# EAGLE design Totem Teensy (EAGLE 9.3.1)
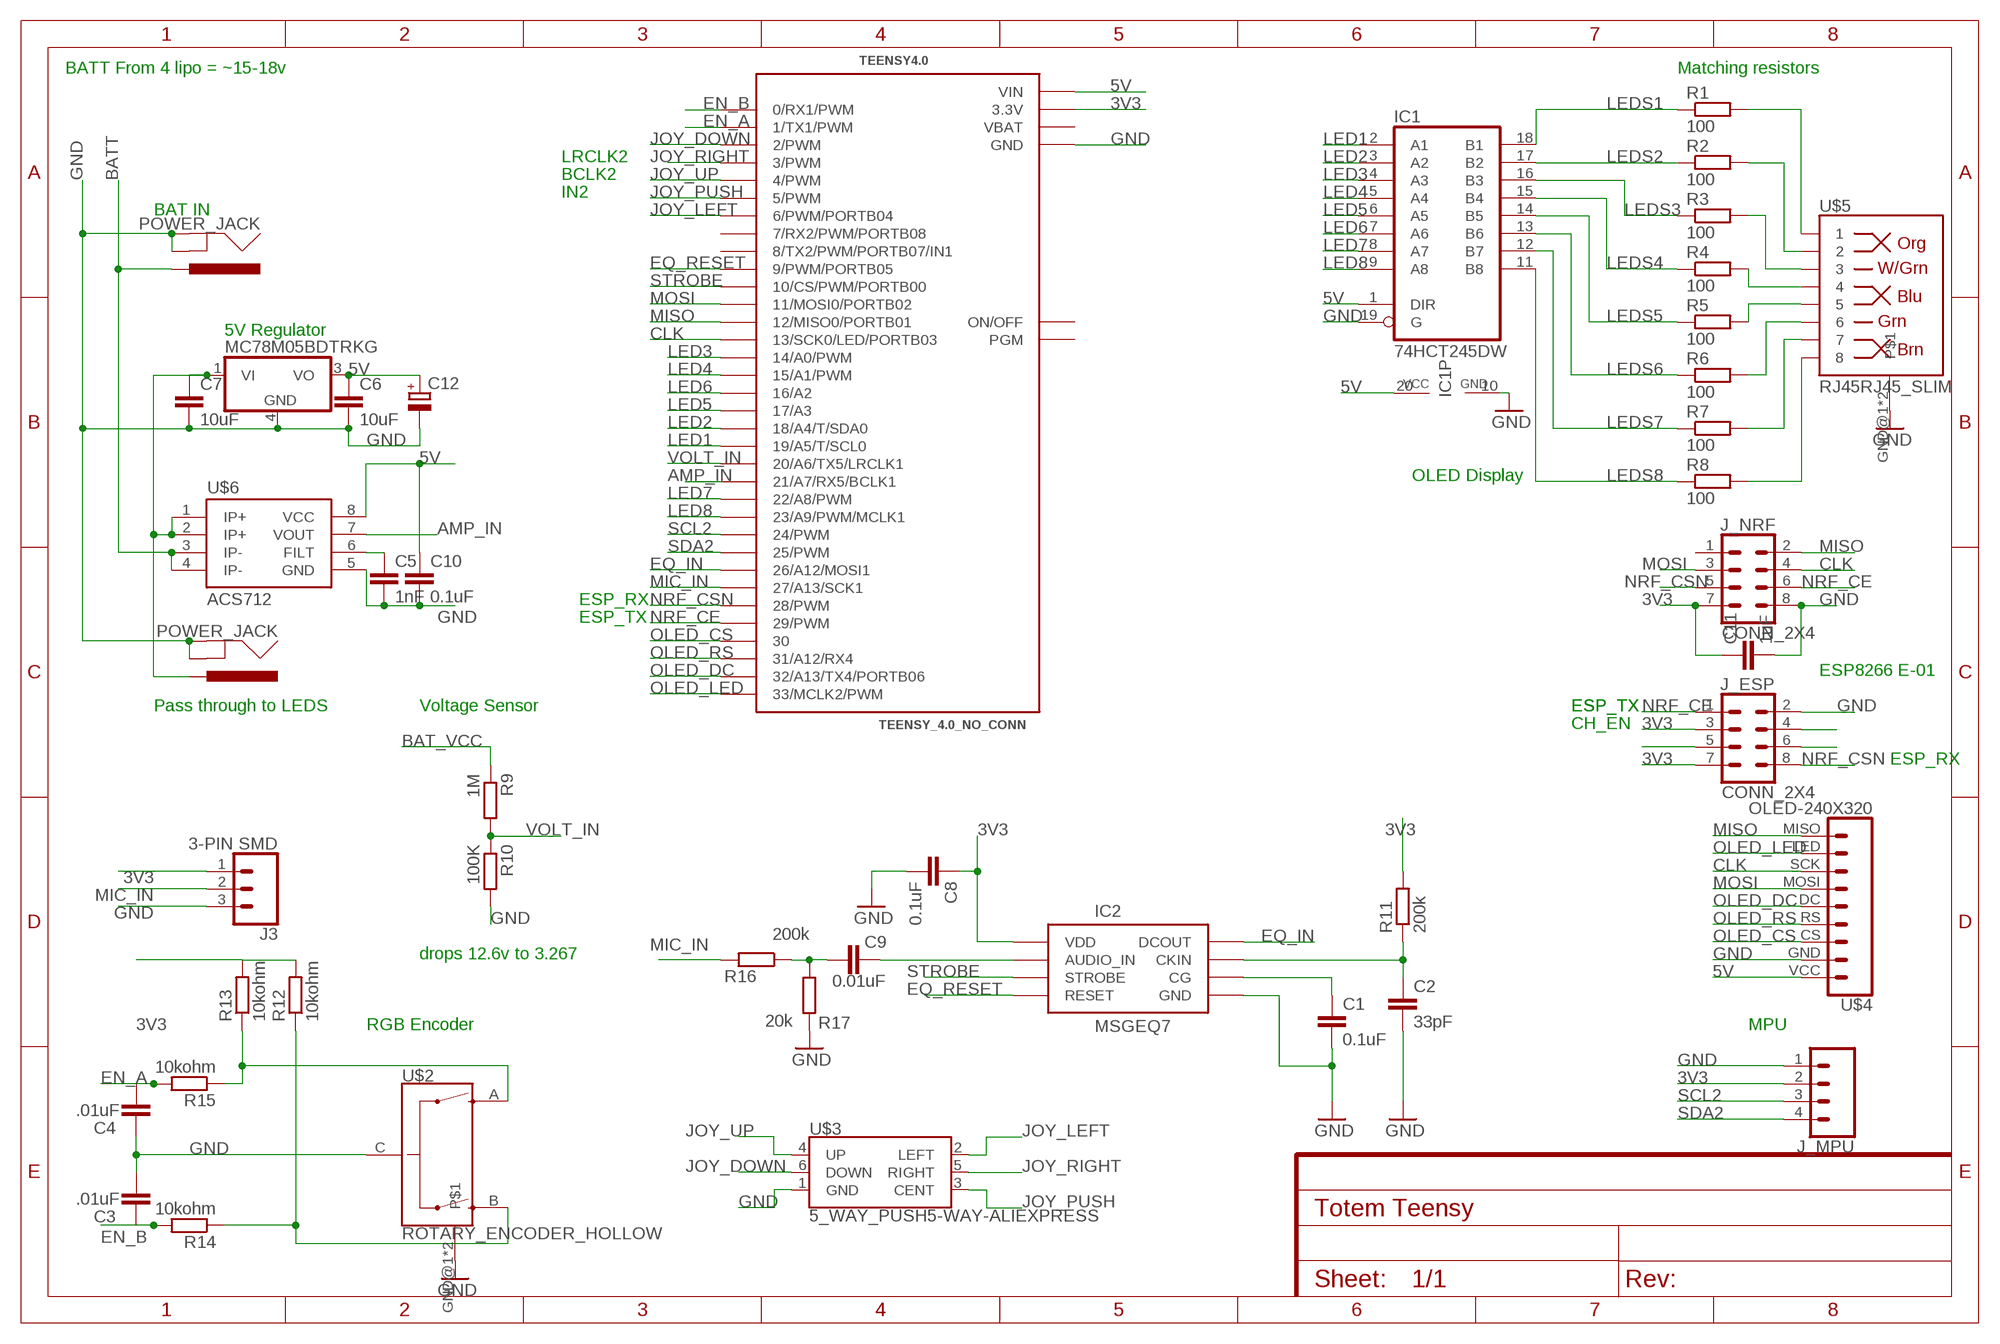
[diagram p0: schematic, sheet 1]

## Parts
C1  0.1uF  CC1206  [C1206]
C2  33pF  CC1206  [C1206]
C3  .01uF  CC1206  [C1206]
C4  .01uF  CC1206  [C1206]
C5  1nF  CC1206  [C1206]
C6  10uF  C-EUC1206  [C1206]
C7  10uF  C-EUC1206  [C1206]
C8  0.1uF  CC1206  [C1206]
C9  0.01uF  CC1206  [C1206]
C10  0.1uF  CC1206  [C1206]
C11  1uF  C-EUC1206  [C1206]
C12  CPOL-EUTT2D5L  [TT2D5L]
IC1  74HCT245DW  [SO20W]
IC2  MSGEQ7DIP  [DIL08]
IC3  MC78M05BDTRKG  [DPACK_3]
J1  POWER_JACK  [POWER_JACK_PTH]
J3  3-PIN SMD  CONN_03JST-SMD  [JST-3-SMD]
J7  POWER_JACK  [POWER_JACK_PTH]
J_ESP  CONN_2X4  [2X4]
J_MPU  CONN_04  [1X04]
J_NRF  CONN_2X4  [2X4]
R1  100  RR1206  [R1206]
R2  100  RR1206  [R1206]
R3  100  RR1206  [R1206]
R4  100  RR1206  [R1206]
R5  100  RR1206  [R1206]
R6  100  RR1206  [R1206]
R7  100  RR1206  [R1206]
R8  100  RR1206  [R1206]
R9  1M  R-EU_M1206  [M1206]
R10  100K  R-EU_M1206  [M1206]
R11  200k  RR1206  [R1206]
R12  10kohm  RR1206  [R1206]
R13  10kohm  RR1206  [R1206]
R14  10kohm  RR1206  [R1206]
R15  10kohm  RR1206  [R1206]
R16  200k  RR1206  [R1206]
R17  20k  RR1206  [R1206]
TEENSY4.0  TEENSY_4.0_NO_CONN  [TEENSY_4.0]
U$2  ROTARY_ENCODER_HOLLOW  [HOLLOW_ENCODER30R]
U$3  5_WAY_PUSH5-WAY-ALIEXPRESS  [5-WAY_PTH2]
U$4  OLED-240X320  [OLED_240X320]
U$5  RJ45RJ45_SLIM  [RJ45_SLIM]
U$6  ACS712  [SO08]

## Nets
3V3: C8.1 C11.1 IC2.1(VDD) J3.1 J_ESP.3 J_ESP.7 J_MPU.2 J_NRF.7 R11.2 R12.2 R13.2 TEENSY4.0.3.3@0(3.3V) TEENSY4.0.3.3@1(3.3V)
5V: C6.1 C10.1 C12.+ IC1.1(DIR) IC1.20(VCC) IC3.3(VO) TEENSY4.0.VIN U$4.VCC U$6.8(VCC)
AMP_IN: TEENSY4.0.21/A7(21/A7/RX5/BCLK1) U$6.7(VOUT)
BAT_VCC: C7.1 IC3.1(VI) J7.PWR R9.1 U$6.1(IP+) U$6.2(IP+)
BATT: J1.PWR U$6.3(IP-) U$6.4(IP-)
CLK: J_NRF.4 TEENSY4.0.13(13/SCK0/LED/PORTB03) U$4.SCK(CLK)
EN_A: C4.1 R15.2 TEENSY4.0.1(1/TX1/PWM)
EN_B: C3.2 R14.2 TEENSY4.0.0(0/RX1/PWM)
EQ_IN: IC2.3(DCOUT) TEENSY4.0.26(26/A12/MOSI1)
EQ_RESET: IC2.7(RESET) TEENSY4.0.9(9/PWM/PORTB05)
GND: C1.2 C2.2 C3.1 C4.2 C5.2 C6.2 C7.2 C8.2 C10.2 C11.2 C12.- IC1.10(GND) IC1.19(G) IC2.2(GND) IC3.4(GND) J1.GND J1.GNDBREAK J3.3 J7.GND J7.GNDBREAK J_ESP.2 J_MPU.1 J_NRF.8 R10.2 R17.2 TEENSY4.0.GND@0(GND) TEENSY4.0.GND@1(GND) TEENSY4.0.GND@2(GND) U$2.C U$2.GND@1 U$2.GND@2 U$3.1(GND) U$4.GND U$5.GND@1 U$5.GND@2 U$6.5(GND)
JOY_DOWN: TEENSY4.0.2(2/PWM) U$3.6(DOWN)
JOY_LEFT: TEENSY4.0.6(6/PWM/PORTB04) U$3.2(LEFT)
JOY_PUSH: TEENSY4.0.5(5/PWM) U$3.3(CENT)
JOY_RIGHT: TEENSY4.0.3(3/PWM) U$3.5(RIGHT)
JOY_UP: TEENSY4.0.4(4/PWM) U$3.4(UP)
LED1: IC1.2(A1) TEENSY4.0.19/A5(19/A5/T/SCL0)
LED2: IC1.3(A2) TEENSY4.0.18/A4(18/A4/T/SDA0)
LED3: IC1.4(A3) TEENSY4.0.14/A0(14/A0/PWM)
LED4: IC1.5(A4) TEENSY4.0.15/A1(15/A1/PWM)
LED5: IC1.6(A5) TEENSY4.0.17/A3
LED6: IC1.7(A6) TEENSY4.0.16/A2
LED7: IC1.8(A7) TEENSY4.0.22/A8(22/A8/PWM)
LED8: IC1.9(A8) TEENSY4.0.23/A9(23/A9/PWM/MCLK1)
LEDS1: IC1.18(B1) R1.1
LEDS2: IC1.17(B2) R2.1
LEDS3: IC1.16(B3) R3.1
LEDS4: IC1.15(B4) R4.1
LEDS5: IC1.14(B5) R5.1
LEDS6: IC1.13(B6) R6.1
LEDS7: IC1.12(B7) R7.1
LEDS8: IC1.11(B8) R8.1
MIC_IN: J3.2 R16.2 TEENSY4.0.27(27/A13/SCK1)
MISO: J_NRF.2 TEENSY4.0.12(12/MISO0/PORTB01) U$4.MISO
MOSI: J_NRF.3 TEENSY4.0.11(11/MOSI0/PORTB02) U$4.MOSI
N$1: R1.2 U$5.8
N$2: R2.2 U$5.7
N$3: R4.2 U$5.5
N$4: R3.2 U$5.6
N$5: R5.2 U$5.4
N$6: R6.2 U$5.3
N$7: R7.2 U$5.2
N$8: R8.2 U$5.1
N$9: J_ESP.4
N$10: J_ESP.6
N$11: J_ESP.5
N$19: C9.2 R16.1 R17.1
N$20: C9.1 IC2.5(AUDIO_IN)
N$21: C5.1 U$6.6(FILT)
N$25: R13.1 R15.1 U$2.A
N$26: R12.1 R14.1 U$2.B
N$27: C2.1 IC2.8(CKIN) R11.1
N$29: C1.1 IC2.6(CG)
NRF_CE: J_ESP.1 J_NRF.6 TEENSY4.0.29(29/PWM)
NRF_CSN: J_ESP.8 J_NRF.5 TEENSY4.0.28(28/PWM)
OLED_CS: TEENSY4.0.30 U$4.CS
OLED_DC: TEENSY4.0.32(32/A13/TX4/PORTB06) U$4.DC
OLED_LED: TEENSY4.0.33(33/MCLK2/PWM) U$4.LED
OLED_RS: TEENSY4.0.31(31/A12/RX4) U$4.RS
SCL2: J_MPU.3 TEENSY4.0.24(24/PWM)
SDA2: J_MPU.4 TEENSY4.0.25(25/PWM)
STROBE: IC2.4(STROBE) TEENSY4.0.10(10/CS/PWM/PORTB00)
VOLT_IN: R9.2 R10.1 TEENSY4.0.20/A6(20/A6/TX5/LRCLK1)
Unconnected: J_NRF.1 TEENSY4.0.7(7/RX2/PWM/PORTB08) TEENSY4.0.8(8/TX2/PWM/PORTB07/IN1) TEENSY4.0.ON/OFF TEENSY4.0.PGM

## Notes on the sheet
- BATT From 4 lipo = ~15-18v | Matching resistors
- LRCLK2
- BCLK2
- IN2
- BAT IN
- 5V Regulator
- OLED Display
- ESP_RX
- ESP_TX
- ESP8266 E-01
- Pass through to LEDS | Voltage Sensor | ESP_TX | ESP_TX
- CH_EN
- ESP_RX
- drops 12.6v to 3.267
- RGB Encoder | MPU

## Power pins joined to a net without a drawn wire
VBAT: TEENSY4.0.VBAT

## Library data of the parts
C1-C5 C8-C10 = eagle-ltspice:C: CAPACITOR, European symbol; SPICEMODEL: NONE; SPICEPREFIX: C
C6 C7 C11 = rcl:C-EU: CAPACITOR, European symbol; SPICEPREFIX: C
C12 = rcl:CPOL-EU: POLARIZED CAPACITOR, European symbol; SPICEPREFIX: C
IC1 = 74xx-eu:74*245: Octal BUS TRANSCEIVER, 3-state
IC2 = msgeq7:MSGEQ7: 7-band graphic equalizer
IC3 = linear:MC78M: 500 mA Positive Voltage Regulators Source: Data sheet <http://www.onsemi.com/pub_link/Collateral/MC78M00-D.PDF>
J1 J7 = SparkFun-Connectors:POWER_JACK: Power Jack Connector This is the standard 5.5mm barrel jack for power. The PTH is the most common, proven, reliable, footprint. The Slot footprint only works if the mill layer is transmitted to the PCB fab house so be warned. Here are the connectors we sell at SparkFun: DC Barrel Power Jack/Connector <https://www.sparkfun.com/products/119> (PRT-00119) DC Barrel Power Jack/Connector (SMD) <https://www.sparkfun.com/products/12748> (PRT-12748) DC Barrel Jack Adapter - Breadboard Compatible <https://www.sparkfun.com/products/10811> (PRT-10811) It is used on this SparkFun product (and many, many others): SparkFun RedBoard - Programmed with Arduino <https://www.sparkfun.com/products/12757> (DEV-12757) Also, if you need a mating power supply or connector, please check these out: Wall Adapter Power Supply - 9VDC 650mA <https://www.sparkfun.com/products/298> (TOL-00298) DC Barrel Jack Adapter - Male <https://www.sparkfun.com/products/10287> (PRT-10287); PROD_ID: CONN-08197
J3 = SparkFun-Connectors:CONN_03: Multi connection point. Often used as Generic Header-pin footprint for 0.1 inch spaced/style header connections On any of the 0.1 inch spaced packages, you can populate with these: Break Away Headers - Straight <https://www.sparkfun.com/products/116> (PRT-00116) Break Away Male Headers - Right Angle <https://www.sparkfun.com/products/553> (PRT-00553) Female Headers <https://www.sparkfun.com/products/115> (PRT-00115) Break Away Headers - Machine Pin <https://www.sparkfun.com/products/117> (PRT-00117) Break Away Female Headers - Swiss Machine Pin <https://www.sparkfun.com/products/743> (PRT-00743) Stackable Header - 3 Pin (Female, 0.1") <https://www.sparkfun.com/products/13875> (PRT-13875) For SCREWTERMINALS and SPRING TERMINALS visit here: Screw Terimnals on SparkFun.com <https://www.sparkfun.com/search/results?term=Screw+Terminals> (5mm/3.5mm/2.54mm spacing) This device is also useful as a general connection point to wire up your design to another part of your project. Our various solder wires solder well into these plated through hole pads. Hook-Up Wire - Assortment (Stranded, 22 AWG) <https://www.sparkfun.com/products/11375> (PRT-11375) Hook-Up Wire - Assortment (Solid Core, 22 AWG) <https://www.sparkfun.com/products/11367> (PRT-11367) View the entire wire category on our website here <https://www.sparkfun.com/categories/141> Special notes: Molex polarized connector foot print use with SKU : PRT-08232 with associated crimp pins and housings.; PROD_ID: CONN-12591
J_ESP J_NRF = myParts:CONN_2X4
J_MPU = SparkFun-Connectors:CONN_04: Multi connection point. Often used as Generic Header-pin footprint for 0.1 inch spaced/style header connections On any of the 0.1 inch spaced packages, you can populate with these: Break Away Headers - Straight <https://www.sparkfun.com/products/116> (PRT-00116) Break Away Male Headers - Right Angle <https://www.sparkfun.com/products/553> (PRT-00553) Female Headers <https://www.sparkfun.com/products/115> (PRT-00115) Break Away Headers - Machine Pin <https://www.sparkfun.com/products/117> (PRT-00117) Break Away Female Headers - Swiss Machine Pin <https://www.sparkfun.com/products/743> (PRT-00743) For SCREWTERMINALS and SPRING TERMINALS visit here: Screw Terimnals on SparkFun.com <https://www.sparkfun.com/search/results?term=Screw+Terminals> (5mm/3.5mm/2.54mm spacing) This device is also useful as a general connection point to wire up your design to another part of your project. Our various solder wires solder well into these plated through hole pads. Hook-Up Wire - Assortment (Stranded, 22 AWG) <https://www.sparkfun.com/products/11375> (PRT-11375) Hook-Up Wire - Assortment (Solid Core, 22 AWG) <https://www.sparkfun.com/products/11367> (PRT-11367) View the entire wire category on our website here <https://www.sparkfun.com/categories/141> Special notes: Molex polarized connector foot print use with SKU : PRT-08231 with associated crimp pins and housings. 1MM SMD Version SKU: PRT-10208; PROD_ID: CONN-09696
R1-R8 R11-R17 = eagle-ltspice:R: RESISTOR, European symbol; SPICEMODEL: NONE; SPICEPREFIX: R
R9 R10 = rcl:R-EU_: RESISTOR, European symbol; SPICEPREFIX: R
TEENSY4.0 = Teensy_3_and_LC_Series_Boards_v1.5:TEENSY_4.0_NO_CONN
U$2 = myParts:ROTARY_ENCODER_HOLLOW: https://au.mouser.com/datasheet/2/15/SRGPSJ-1155941.pdf
U$3 = myParts:5_WAY_PUSH: pth2 - https://www.aliexpress.com/item/33020121294.html?spm=a2g0s.9042311.0.0.75f24c4dOQCrTt
U$4 = myParts:OLED-240X320
U$5 = myParts:RJ45: Regular one https://www.digikey.com.au/product-detail/en/assmann-wsw-components/A-2004-2-4-LP-S-R/AE10388-ND/2183639 Same as one from ali express too Slim one https://www.aliexpress.com/item/32974903992.html?spm=a2g0s.9042311.0.0.62954c4dfgLHeB
U$6 = SparkFun-Sensors:ACS712: ACS712 Hall-effect-based isolated linear current sensor Datasheet <http://www.sparkfun.com/datasheets/BreakoutBoards/0712.pdf> SparkFun Products SparkFun Low Current Sensor Breakout - ACS712 <https://www.sparkfun.com/products/8883> (SEN-08883); PROD_ID: IC-08964

## Board
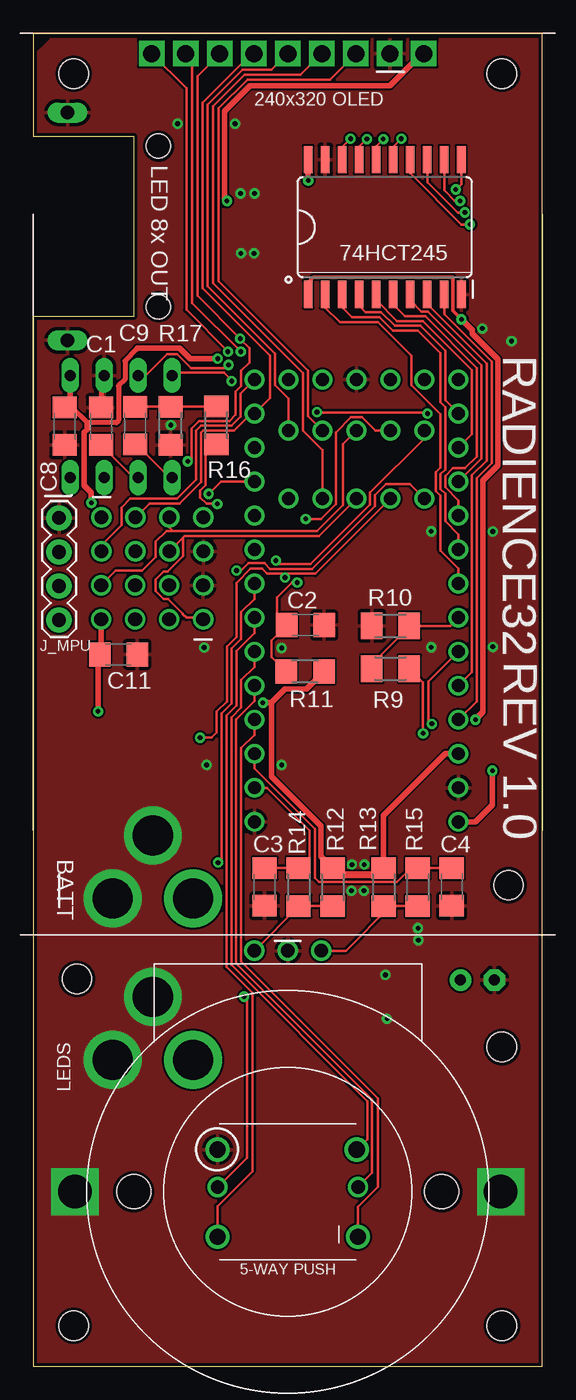
[diagram p1: board, top side]
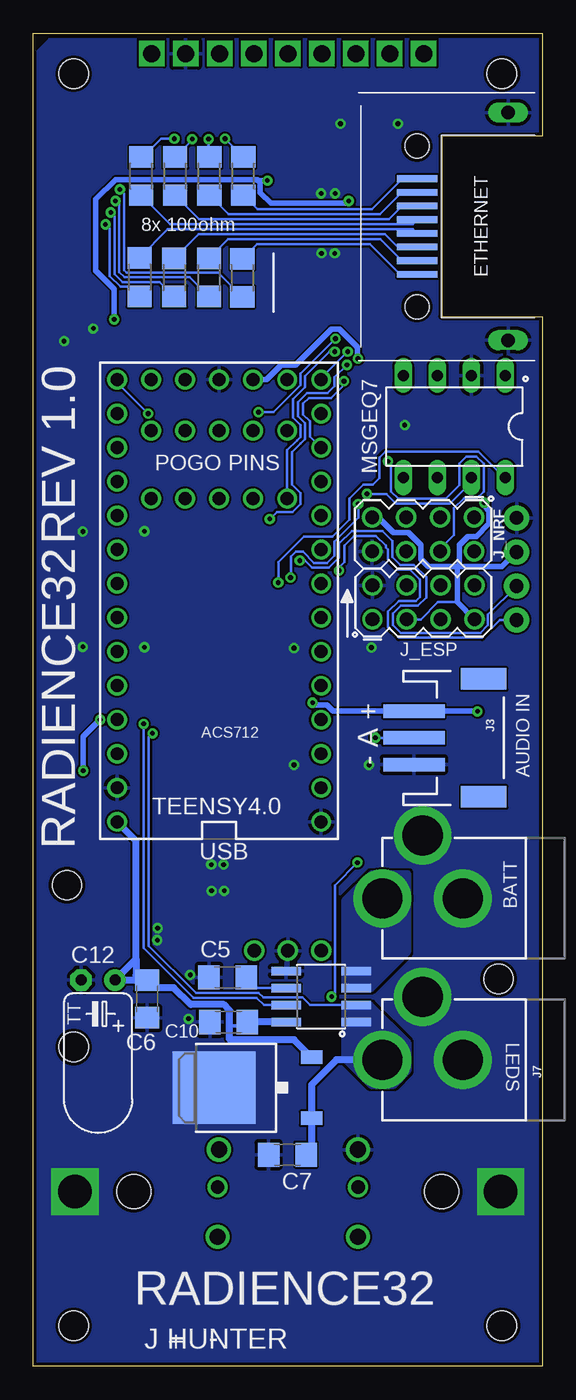
[diagram p2: board, bottom side, seen from below]

Size 38 x 99.5 mm. Coordinates in mm from the lower left corner, seen from the top.
Outline: 0,0 38,0 38,99.5 0,99.5 0,91.82 7.49,91.82 7.49,78.36 0,78.36 0,0
Copper layers (1*16): Top 0.035mm / dielectric 1.5mm / Bottom 0.035mm
Design rules "default *": minimum track width 6mil, minimum drill 0.3mm, track to track 6mil, track to pad 6mil, pad to pad 6mil, via to via 6mil, smd to smd 6mil, copper to edge 10mil, drill to drill 6mil, minimum pad ring 10mil, minimum via ring 8mil, stop-mask expansion 4mil, vias tented up to drill 0mil, thermal gap 10mil
Holes 2.2 mm at 35,3 3,3 35,96.5 3,96.5 3.25,28.9 35,23.82 35.5,35.9

### Footprints (pad centres in the part's own frame; a part is rotated, then mirrored left to right if it is on the bottom)
C1206 = smd 1.6 x 1.8: 1 -1.4,0; 2 1.4,0
TT2D5L = drill 0.813 pad 1.6: + -1.27,0 | drill 0.813 pad 1.6 octagon: - 1.27,0
SO20W = smd 0.66 x 2.032: 1 -5.715,-5.029; 2 -4.445,-5.029; 3 -3.175,-5.029; 4 -1.905,-5.029; 5 -0.635,-5.029; 6 0.635,-5.029; 7 1.905,-5.029; 8 3.175,-5.029; 9 4.445,-5.029; 10 5.715,-5.029; 11 5.715,5.029; 12 4.445,5.029; 13 3.175,5.029; 14 1.905,5.029; 15 0.635,5.029; 16 -0.635,5.029; 17 -1.905,5.029; 18 -3.175,5.029; 19 -4.445,5.029; 20 -5.715,5.029
DIL08 = drill 0.813 long: 1 -3.81,-3.81; 2 -1.27,-3.81; 3 1.27,-3.81; 4 3.81,-3.81; 5 3.81,3.81; 6 1.27,3.81; 7 -1.27,3.81; 8 -3.81,3.81
DPACK_3 = smd 1 x 1.6: 1 -2.28,-4.8; 3 2.28,-4.8 | smd 5.4 x 6.2: 4 0,2.5
POWER_JACK_PTH = drill 2.997 pad 4.318: GND 0,7.7; GNDBREAK 4.7,10.7; PWR 0,13.7
JST-3-SMD = smd 1 x 4.6: 1 -1.99,-4.77; 2 0.01,-4.77; 3 2.01,-4.77 | smd 1.6 x 3.4: NC1 -4.39,0.43; NC2 4.41,0.43
2X4 = drill 1.016: 1 -3.81,-1.27; 2 -3.81,1.27; 3 -1.27,-1.27; 4 -1.27,1.27; 5 1.27,-1.27; 6 1.27,1.27; 7 3.81,-1.27; 8 3.81,1.27
1X04 = drill 1.016 pad 1.88: 1 0,0; 2 2.54,0; 3 5.08,0; 4 7.62,0
R1206 = smd 1.6 x 1.803: 1 -1.422,0; 2 1.422,0
M1206 = smd 1.6 x 2: 1 -1.4,0; 2 1.4,0
TEENSY_4.0 = drill 0.965: 0 -7.62,13.97; 1 -7.62,11.43; 2 -7.62,8.89; 3 -7.62,6.35; 3.3@0 -2.54,-16.51; 3.3@1 7.62,11.43; 4 -7.62,3.81; 5 -7.62,1.27; 6 -7.62,-1.27; 7 -7.62,-3.81; 8 -7.62,-6.35; 9 -7.62,-8.89; 10 -7.62,-11.43; 11 -7.62,-13.97; 12 -7.62,-16.51; 13 7.62,-16.51; 14/A0 7.62,-13.97; 15/A1 7.62,-11.43; 16/A2 7.62,-8.89; 17/A3 7.62,-6.35; 18/A4 7.62,-3.81; 19/A5 7.62,-1.27; 20/A6 7.62,1.27; 21/A7 7.62,3.81; 22/A8 7.62,6.35; 23/A9 7.62,8.89; 24 5.08,-12.7; 25 5.08,-7.62; 26 2.54,-12.7; 27 2.54,-7.62; 28 0,-12.7; 29 0,-7.62; 30 -2.54,-12.7; 31 -2.54,-7.62; 32 -5.08,-12.7; 33 -5.08,-7.62; GND@0 -7.62,16.51; GND@1 7.62,13.97; GND@2 0,-16.51; ON/OFF 5.08,-16.51; PGM 2.54,-16.51; VBAT -5.08,-16.51; VIN 7.62,16.51
HOLLOW_ENCODER30R = drill 1: A -2.5,-18; B 2.5,-18; C 0,-18 | drill 2.5 pad 3 square: GND@1 -15.9,0; GND@2 15.9,0 | hole 2.55: -11.5,0; 11.5,0
5-WAY_PTH2 = drill 1.2: 1 -5.25,3.15; 3 -5.25,-3.35; 4 5.15,3.15; 6 5.25,-3.35 | drill 1: 2 -5.25,0.35; 5 5.25,0.35
OLED_240X320 = drill 1.27 square: CS 5.08,0; DC 0,0; GND 7.62,0; LED -7.62,0; MISO -10.16,0; MOSI -2.54,0; RS 2.54,0; SCK -5.08,0; VCC 10.16,0
RJ45_SLIM = smd 0.5 x 3: 1 -3.57,6.8; 2 -2.55,6.8; 3 -1.53,6.8; 4 -0.51,6.8; 5 0.51,6.8; 6 1.53,6.8; 7 2.55,6.8; 8 3.57,6.8 | drill 1 long: GND@1 8.5,0; GND@2 -8.5,0 | hole 1.8: -6,6.8; 6,6.8
SO08 = smd 0.61 x 2.21: 1 -1.905,-2.616; 2 -0.635,-2.616; 3 0.635,-2.616; 4 1.905,-2.616; 5 1.905,2.616; 6 0.635,2.616; 7 -0.635,2.616; 8 -1.905,2.616

### Placement (x,y rotation side)
C1  5.05,70.18 90 top
C2  20.32,55.32 0 top
C3  17.27,35.76 90 top
C4  31.24,35.76 270 top
C5  23.5,29.03 180 bottom
C6  29.51,27.41 270 bottom
C7  19.03,15.77 180 bottom
C8  2.34,70.18 270 top
C9  7.59,70.21 90 top
C10  23.42,25.68 180 bottom
C11  6.35,53.14 0 top
C12  33.17,28.83 180 bottom
IC1  26.24,85.04 0 top
IC2  6.55,70.15 180 bottom
IC3  22.02,20.78 90 bottom
J1  -1.78,34.92 90 bottom
J3  4.8,46.91 270 bottom
J7  -1.78,22.86 90 bottom
J_ESP  8.86,57.02 0 bottom
J_MPU  1.91,63.32 270 top
J_NRF  8.89,62.1 180 bottom
R1  22.33,88.85 270 bottom
R2  24.87,88.85 270 bottom
R3  27.41,88.85 270 bottom
R4  29.95,88.85 270 bottom
R5  30.07,81.31 90 bottom
R6  27.48,81.28 90 bottom
R7  24.89,81.28 90 bottom
R8  22.4,81.25 90 bottom
R9  26.67,52.07 180 top
R10  26.67,55.27 180 top
R11  20.29,51.87 0 top
R12  22.35,35.76 90 top
R13  26.16,35.76 90 top
R14  19.81,35.76 90 top
R15  28.7,35.76 90 top
R16  13.67,70.23 270 top
R17  10.24,70.21 270 top
TEENSY4.0  24.13,57.15 180 bottom
U$2  19,13.01 180 top
U$3  19,13.01 0 top
U$4  19,98 0 top
U$5  2.54,85.09 90 bottom
U$6  16.51,27.58 90 bottom

### Tracks (layer width: path | path; a pad name or v marks a point on that pad's centre or on a via)
3V3  (via drill 0.35)
  Top 0.203: 5.05,53.24 C11.1
  Top 0.356: 7.76,76 7.76,75.96 6.83,75.04 6.83,73.66 6.36,73.19 6.36,70.6 6.21,70.44 4.01,70.44 2.87,71.58 C8.1
  Top 0.406: TEENSY4.0.3.3@1 30.76,45.72 26.16,41.12 R13.2 | IC2.1 2.74,71.99 C8.1 | v13.76,75.22 11.71,75.22 10.93,76 7.76,76 | R11.2 20.41,50.56 18.81,50.56 17.78,49.53 | 17.78,49.53 17.78,48.26 | 17.78,48.26 17.78,44 21.48,40.31 21.48,38.06 R12.2 | 17.78,49.53 17.78,48.26 | 17.78,49.53 v17.14,49.53 | J_ESP.7 5.05,53.24 | C11.1 4.83,53.01 v4.83,48.88 | v4.33,64.45 4.33,65.2 3.8,65.73 3.8,69.73 4,69.93 4,70.44 4.01,70.44
  Top 0.508: R12.2 22.88,36.66 25.63,36.66 R13.2
  Bottom 0.203: 6.35,57.05 7.77,57.05 9.07,55.75 J_ESP.3 | J3.1 10.16,48.9
  Bottom 0.406: J_NRF.7 12.27,63.37 11.12,62.23 9.98,62.23 9.04,61.3 9.04,60.24 8.49,59.69 6.35,59.69 | J_MPU.2 3,59.69 6.35,59.69 | J_ESP.7 6.35,57.05 6.35,59.69 | v13.76,75.22 13.79,75.25 13.79,76.1 15.14,77.44 15.75,77.44 18.44,74.75 19.5,74.75 20.59,73.66 TEENSY4.0.3.3@0 | v17.14,49.53 16.96,49.35 16.06,49.35 15.61,48.9 10.16,48.9 J3.1 4.85,48.9 v4.83,48.88 | v4.33,64.45 4.33,64.2 3.96,63.84 3.96,62.91 4.92,61.95 5.54,61.95 6.2,61.3 6.2,59.84 6.35,59.69
5V  (via drill 0.35)
  Top 0.254: v31.98,78.16 31.32,78.82 31.32,81.31 20.92,81.31 20.58,80.97 20.52,80.97 IC1.1
  Top 0.406: v20.52,88.52 IC1.20 | v14.45,87 14.28,87.17 14.28,93.71 16.17,95.61 26.63,95.61 29.03,98 U$4.VCC | v31.98,78.16 32.79,77.34 32.79,77.07 34.7,75.17 34.7,67.25 33.58,66.13 33.58,48.82 v33.02,48.26 | v34.29,44.45 34.29,41.91 33.02,40.64 TEENSY4.0.VIN
  Bottom 0.254: 23.34,25.4 22.3,25.4 C10.1
  Bottom 0.406: v20.52,88.52 21.21,88.52 21.29,88.59 21.59,88.59 | v31.98,78.16 31.98,80.42 33.35,81.78 33.35,87.12 31.88,88.59 21.59,88.59 | 21.59,88.59 21.58,88.58 21.28,88.58 21.07,88.37 21.07,87.63 20.26,86.82 14.62,86.82 v14.45,87 | v33.02,48.26 34.29,46.99 v34.29,44.45
  Bottom 0.508: TEENSY4.0.VIN 30.33,39.22 30.33,31.06 30.33,30.4 | U$6.8 C10.1 | IC3.3 18.52,24.36 23.34,24.36 23.34,25.4 23.34,26.55 23.77,26.99 26.26,26.99 27.53,28.25 28.96,28.25 C6.1 | 30.33,30.4 30.33,29.19 29.95,28.81 C6.1 | C6.1 31.88,28.81 C12.+ 30.33,30.4
AMP_IN  (via drill 0.35)
  Top 0.203: v29.77,47.95 29.51,48.2 29.51,51.1 TEENSY4.0.21/A7
  Bottom 0.203: v29.77,47.95 29.77,31.21 26.05,27.49 21.32,27.49 20.77,26.95 U$6.7
BAT_VCC  (via drill 0.35)
  Top 0.203: R9.1 29.11,51.03 v29.11,47.24
  Bottom 0.203: v29.11,47.24 29.39,46.97 29.39,31.39 25.85,27.85 21.17,27.85 20.83,27.51 17.92,27.51 17.36,26.95 U$6.2
  Bottom 0.508: J7.PWR 15.37,22.86 17.22,21 IC3.1 17.22,16.18 C7.1
  pour Bottom (no thermals): 14.73,22.91 14.73,27 13.06,27 13.03,26.97 12.85,26.97 10.03,24.16 10.03,22.02 11.13,20.93 12.75,20.93
BATT
  pour Bottom (isolate 0.051, no thermals): 10.03,30.94 10.03,36.75 12.75,36.75 14.76,34.75 14.76,28.17 12.8,28.17
CLK  (via drill 0.35)
  Top 0.203: U$4.SCK 12.24,96.32 12.24,79.91 v15.44,76.71 15.44,76.69 16.12,76.01 16.12,74.93 15.52,74.33 15.52,73.17 15.1,72.75 15.1,72.39 15.1,71.03 14.65,70.57 12.36,70.57 11.8,70.01 11.8,67.51 11.76,67.56 v11.52,67.56 | v21.18,71.22 21.21,71.2 29.36,71.2 v29.44,71.12
  Bottom 0.203: v15.44,76.71 18.06,74.09 18.06,73.23 20.07,71.22 v21.18,71.22 | v11.52,67.56 11.28,67.31 11.28,65.31 10.74,64.77 7.62,64.77 7.19,64.77 6.2,65.76 6.2,67.38 5.66,67.92 4.9,67.92 4.37,67.38 4.37,65.31 4.9,64.77 5.86,64.77 6.58,64.05 6.58,62.05 7.62,61.01 J_NRF.4 | v29.44,71.12 31.75,73.43 TEENSY4.0.13
EN_A
  Top 0.203: C4.1 31.22,37.19 R15.2 28.22,37.19 27.17,36.13 21.34,36.13 21.02,36.46 21.02,40.12 16.51,44.63 TEENSY4.0.1
EN_B
  Top 0.203: C3.2 17.29,37.19 R14.2 20.62,38 20.62,40.01 17.45,43.18 TEENSY4.0.0
EQ_IN  (via drill 0.35)
  Top 0.203: TEENSY4.0.26 25.53,69.85 24.54,70.84 23.72,70.84 22.58,69.7 22.58,64.36 21.47,63.25 v20.34,63.25 | IC2.3 7.92,73.86 8.31,73.86 9.98,75.54 10.74,75.54 11.76,74.52 14.35,74.52 v14.58,74.75
  Bottom 0.203: v14.58,74.75 15.51,73.83 15.51,73.17 16.03,72.64 17.58,72.64 18.24,71.99 18.24,70.94 17.7,70.41 17.7,69.22 | 17.7,69.22 18.06,68.86 | 18.06,68.86 18.69,68.23 18.69,65.81 18.06,65.18 18.06,64.36 18.64,63.78 19.82,63.78 v20.34,63.25 | 18.06,68.86 17.7,69.22
EQ_RESET  (via drill 0.35)
  Top 0.203: TEENSY4.0.9 14.01,66.04 v13.09,65.13
  Bottom 0.203: IC2.7 5.28,66.01 6.88,64.41 10.91,64.41 11.62,65.13 v13.09,65.13
GND  (via drill 0.35)
  Top 0.356: IC2.2 5.05,73.74 C1.2
  other vias: 24.71,37.44 23.8,37.44 23.75,35.48 24.69,35.48 18.54,44.88 10.77,92.76 15.06,92.76 18.54,53.62 29.72,62.33 29.72,53.67 34.32,53.7 34.32,62.31 35.71,76.53 33.53,77.47 12.75,53.64 15.49,83.08 15.47,87.55 12.93,44.88 16.51,87.55 28.73,32.69 28.75,31.8 26.41,25.93 26.29,29.21 16.48,83.08 10.26,70.26
  pour Bottom (rank 3): -1.27,99.06 -1.27,0 38.1,0 38.1,97.79 36.83,99.06
  pour Top (rank 3): 1.27,99.06 0,97.79 0,96.52 -1.27,95.25 -1.27,0 38.1,0 38.1,99.06
JOY_DOWN
  Top 0.203: TEENSY4.0.2 16.51,47.12 15.52,46.13 15.52,31.45 15.49,31.43 15.49,30.23 25.73,19.99 25.73,13.39 24.25,11.91 U$3.6
JOY_LEFT  (via drill 0.35)
  Top 0.203: v13.79,37.59 14.05,37.85 14.05,48.26 14.05,48.71 14.81,49.47 14.81,53.57 15.52,54.28 15.52,56.29 16.51,57.28 TEENSY4.0.6 | v15.72,27.58 15.95,27.35 15.95,15.56 U$3.2
  Bottom 0.203: v13.79,37.59 15.49,35.89 15.49,31.43 15.49,30.59 15.49,27.94 15.49,27.81 v15.72,27.58
JOY_PUSH
  Top 0.203: TEENSY4.0.5 16.51,54.74 15.16,53.4 15.16,49.32 14.43,48.58 14.43,48.26 14.43,29.79 16.36,27.85 16.36,14.54 13.75,11.93 U$3.3
JOY_RIGHT
  Top 0.203: TEENSY4.0.3 16.51,49.66 15.14,48.29 15.14,30.08 25.3,19.91 25.3,14.41 U$3.5
JOY_UP
  Top 0.203: TEENSY4.0.4 16.51,52.2 15.52,51.21 15.52,49.17 14.78,48.44 14.78,46.99 14.78,29.93 24.93,19.78 24.93,16.94 U$3.4
LED1
  Top 0.203: IC1.2 21.79,79.04 22.89,77.95 25.72,77.95 28.22,75.45 28.22,73.25 30.4,71.06 30.4,67.1 30.05,66.75 30.05,65.33 30.4,64.98 30.4,60.91 31.75,59.56 TEENSY4.0.19/A5
LED2
  Top 0.203: IC1.3 23.06,79.07 23.8,78.33 25.84,78.33 26.86,77.32 28.73,77.32 30.4,75.64 30.4,71.96 30.76,71.61 30.76,66.95 30.4,66.6 30.4,65.48 30.76,65.13 30.76,63.09 31.75,62.1 TEENSY4.0.18/A4
LED3
  Top 0.203: IC1.4 24.33,79.17 24.79,78.71 25.96,78.71 27,77.67 28.91,77.67 30.76,75.83 30.76,72.11 TEENSY4.0.14/A0
LED4
  Top 0.203: IC1.5 25.6,79.58 27.15,78.03 29.09,78.03 32.77,74.35 32.77,69.6 TEENSY4.0.15/A1
LED5
  Top 0.203: TEENSY4.0.17/A3 31.75,64.64 30.76,65.63 30.76,66.45 31.34,67.03 32.23,67.03 33.12,67.92 33.12,74.52 29.26,78.38 27.73,78.38 26.87,79.24 IC1.6
LED6
  Top 0.203: IC1.7 28.14,79.58 28.98,78.74 29.47,78.74 33.48,74.74 33.48,67.77 TEENSY4.0.16/A2
LED7
  Top 0.203: TEENSY4.0.22/A8 32.77,51.82 32.77,66.52 33.86,67.61 33.86,74.86 29.39,79.33 29.39,79.98 IC1.8
LED8
  Top 0.203: IC1.9 30.68,78.54 34.24,74.98 34.24,67.44 33.12,66.32 33.12,49.63 TEENSY4.0.23/A9
LEDS1  (via drill 0.35)
  Top 0.203: v23.69,91.65 23.06,91.02 IC1.18
  Bottom 0.203: R1.1 23.69,91.64 v23.69,91.65
LEDS2  (via drill 0.35)
  Top 0.203: IC1.17 24.33,91.03 v24.92,91.62
  Bottom 0.203: v24.92,91.62 24.92,90.32 R2.1
LEDS3  (via drill 0.35)
  Top 0.203: v26.14,91.62 25.6,91.08 IC1.16
  Bottom 0.203: R3.1 26.14,91.54 v26.14,91.62
LEDS4  (via drill 0.35)
  Top 0.203: IC1.15 26.87,91.06 27.45,91.64 v27.48,91.64
  Bottom 0.203: R4.1 29.84,90.27 28.47,91.64 v27.48,91.64
LEDS5  (via drill 0.35)
  Top 0.203: v32.61,85.24 31.98,85.24 28.14,89.08 IC1.14
  Bottom 0.203: R5.1 30.77,80.58 31.5,80.58 32.3,81.38 32.3,84.92 v32.61,85.24
LEDS6  (via drill 0.35)
  Top 0.203: IC1.13 29.44,90.04 29.44,88.39 31.7,86.13 v32.22,86.13 v32.23,86.14
  Bottom 0.203: R6.1 28.56,80.94 31.35,80.94 31.94,81.53 31.94,85.84 32.23,86.13 v32.23,86.14
LEDS7  (via drill 0.35)
  Top 0.203: IC1.12 30.68,87.81 31.5,87 v31.87,87
  Bottom 0.203: R7.1 26.33,81.29 31.2,81.29 31.59,81.67 31.59,86.71 v31.87,87
LEDS8  (via drill 0.35)
  Top 0.203: IC1.11 31.95,88.27 v31.55,87.86
  Bottom 0.203: R8.1 24.22,81.65 31.05,81.65 31.23,81.82 31.23,87.54 v31.55,87.86
MIC_IN  (via drill 0.35)
  Top 0.203: TEENSY4.0.27 21.06,59.16 18.52,59.16 | v12.45,46.91 13.31,46.91 13.69,47.29 13.69,48.85 14.45,49.62 14.45,53.72 15.16,54.43 15.16,58.48 16.23,59.54 17.08,59.54 17.46,59.16 18.52,59.16 | v18.8,58.88 18.52,59.16 | R16.2 12.87,68.01 12.87,65.79 12.46,65.39 12.46,64.86 12.93,64.39 13.72,64.39 v13.74,64.37
  Bottom 0.203: v12.45,46.91 v12.44,46.9 J3.2 | v13.74,64.37 13.74,63.36 15.52,61.58 15.52,60.52 16.07,59.97 17.04,59.97 17.87,60.8 18.4,60.8 18.77,60.43 18.77,58.91 v18.8,58.88
MISO  (via drill 0.35)
  Top 0.203: TEENSY4.0.12 15.46,72.61 15.46,70.88 14.8,70.22 12.51,70.22 12.15,69.87 12.15,66.18 10.74,64.77 7.24,64.77 6.58,64.11 6.58,62.8 5.08,61.3 J_NRF.2 | U$4.MISO 11.43,95.41 11.43,78.87 14.55,75.74 v14.53,75.74
  Bottom 0.203: TEENSY4.0.12 16.51,73.76 v14.53,75.74
MOSI
  Top 0.203: U$4.MOSI 16.3,98 12.62,94.33 12.62,80.49 17.68,75.44 17.68,72.29 TEENSY4.0.11 16.26,71.12 15,69.86 12.66,69.86 12.51,69.71 12.51,66.01 10.91,64.41 8.66,64.41 J_NRF.3
N$1
  Bottom 0.203: U$5.8 10.43,88.66 12.73,86.36 21.26,86.36 R1.2
N$2
  Bottom 0.203: R2.2 23.43,85.99 12.13,85.99 10.48,87.64 U$5.7
N$3
  Bottom 0.203: R4.2 27.79,85.27 9.67,85.27 U$5.5
N$4
  Bottom 0.203: R3.2 25.61,85.63 11.45,85.63 10.46,86.62 U$5.6
N$5
  Bottom 0.203: R5.2 30.07,82.78 27.97,84.89 9.64,84.89 U$5.4
N$6
  Bottom 0.203: R6.2 25.68,84.51 11.73,84.51 10.79,83.56 U$5.3
N$7
  Bottom 0.203: R7.2 23.47,84.12 12.07,84.12 10.48,82.54 U$5.2
N$8
  Bottom 0.203: R8.2 21.31,83.77 12.86,83.77 10.61,81.52 U$5.1
N$19
  Top 0.203: C9.2 7.62,71.63 R17.1 13.64,71.63 R16.1
N$20
  Top 0.203: IC2.5 10.18,66.34 7.72,68.81 C9.1
N$21
  Bottom 0.203: C5.1 21.28,28.22 U$6.6
N$25
  Top 0.203: R13.1 26.67,34.34 | 26.67,34.34 R15.1 | U$2.A 23.34,31.01 26.67,34.34
N$26
  Top 0.203: R12.1 R14.1 19.81,34.32 U$2.B
N$27  (via drill 0.35)
  Top 0.203: v19.71,58.5 19.33,58.5 18.21,57.38 18.21,56.03 C2.1 17.78,54.18 17.78,52.93 18.85,51.87 R11.1
  Bottom 0.203: IC2.8 2.83,66.34 4.76,68.28 11.7,68.28 12.15,67.82 12.15,66.31 12.65,65.81 13.35,65.81 14.39,64.77 14.39,63.21 15.65,61.95 17.79,61.95 19.71,60.02 19.71,59.49 v19.71,58.5
N$29
  Top 0.203: IC2.6 7.49,66.34 C1.1
NRF_CE
  Top 0.203: TEENSY4.0.29 21.34,61.98 20.95,61.98 11.3,61.98 J_NRF.6 11.18,61.85 11.18,60.48 10.01,59.31 9.71,59.31 9.12,58.71 9.12,57.87 9.71,57.28 10.05,57.28 11.15,56.17 11.15,56.16 11.43,55.88 12.55,55.88 J_ESP.1
NRF_CSN
  Top 0.203: J_ESP.8 6.15,59.38 8.11,59.38 9.14,60.41 9.14,61.56 9.93,62.34 11.19,62.34 | TEENSY4.0.28 23.11,68.83 23.11,64.28 21.18,62.34 11.19,62.34 | 11.19,62.34 10.43,62.34 10.16,62.61 J_NRF.5
OLED_CS
  Top 0.203: U$4.CS 22.14,96.06 15.98,96.06 13.82,93.9 13.82,81.02 20.52,74.32 20.52,70.92 TEENSY4.0.30
OLED_DC
  Top 0.203: U$4.DC 17.78,96.78 15.6,96.78 13.01,94.18 13.01,80.64 18.06,75.59 18.06,73.23 19.05,72.24 TEENSY4.0.32
OLED_LED  (via drill 0.35)
  Top 0.203: U$4.LED 11.86,97.52 11.86,79.38 v15.49,75.75
  Bottom 0.203: TEENSY4.0.33 19.05,68.38 18.31,69.11 18.06,69.37 18.06,70.26 18.6,70.8 18.6,72.18 17.7,73.08 17.7,73.92 15.87,75.75 v15.49,75.75
OLED_RS
  Top 0.203: U$4.RS 19.96,96.42 15.75,96.42 13.41,94.08 13.41,80.85 20.12,74.14 20.12,69.85 21.59,68.38 TEENSY4.0.31
SCL2  (via drill 0.35)
  Top 0.203: TEENSY4.0.24 29.21,69.27 25.15,65.2 25.15,64.34 20.7,59.89 18.03,59.89 18.01,59.92 18.11,60.02 v18.11,60.14
  Bottom 0.203: J_MPU.3 4.04,56.11 4.04,55.33 4.63,54.74 10.55,54.74 11.15,55.33 11.15,56.17 10.55,56.77 9.27,56.77 8.66,57.38 8.66,58.9 9.58,59.82 10.58,59.82 11.18,60.41 11.18,61.59 11.94,62.36 14.22,62.36 15.16,61.42 15.16,60.38 15.93,59.61 17.19,59.61 17.72,60.14 v18.11,60.14
SDA2  (via drill 0.35)
  Top 0.203: TEENSY4.0.25 28.12,65.86 26.31,65.86 25.5,65.05 25.5,64.19 20.82,59.51 17.68,59.51 17.25,59.95 16.06,59.95 15.51,59.4 v15.17,59.4
  Bottom 0.203: J_MPU.4 3.17,55.7 4.49,54.38 10.7,54.38 11.51,55.19 11.51,56.32 10.7,57.12 9.42,57.12 9.12,57.42 9.12,58.71 9.87,59.46 10.73,59.46 11.53,60.27 11.53,60.96 11.68,61.11 11.68,61.25 12.41,61.98 14.05,61.98 14.76,61.27 14.76,60.02 15.17,59.61 v15.17,59.4
STROBE  (via drill 0.35)
  Top 0.203: v14.81,73.54 14.81,73.59 14.23,74.17 10.57,74.17 IC2.4
  Bottom 0.203: v14.81,73.54 14.81,73.25 15.77,72.29 17.43,72.29 17.85,71.88 17.85,71.05 17.35,70.56 17.35,69.42 TEENSY4.0.10
VOLT_IN
  Top 0.203: TEENSY4.0.20/A6 31.14,55.27 R10.1 28.07,55.2 25.27,52.4 R9.2

### Text on the board
tNames: 240x320 OLED | LED 8x OUT | 74HCT245 | RADIENCE32 | REV 1.0 | BATT | LEDS | 5-WAY PUSH
bNames: ETHERNET | 8x 100ohm | MSGEQ7 | POGO PINS | REV 1.0 | ACS712 | - A + | AUDIO IN | RADIENCE32 | USB | BATT | LEDS | RADIENCE32 | - + | J HUNTER